# Altium schematic sheet [04]-Connector.SchDoc: ENTER SHEET TITLE
size B; Engineer: ENTER ENGINEER NAME; Organization: CUAir; Address1: L3, 12a Rodborough Rd; Address2: Frenchs Forest; Address3: NSW; Address4: Australia 2086; Revision: ENTER REVISION NUMBER; CompetitionYear: 2019; CPN: ENTER CPN; PROJECT: ENTER PROJECT NAME
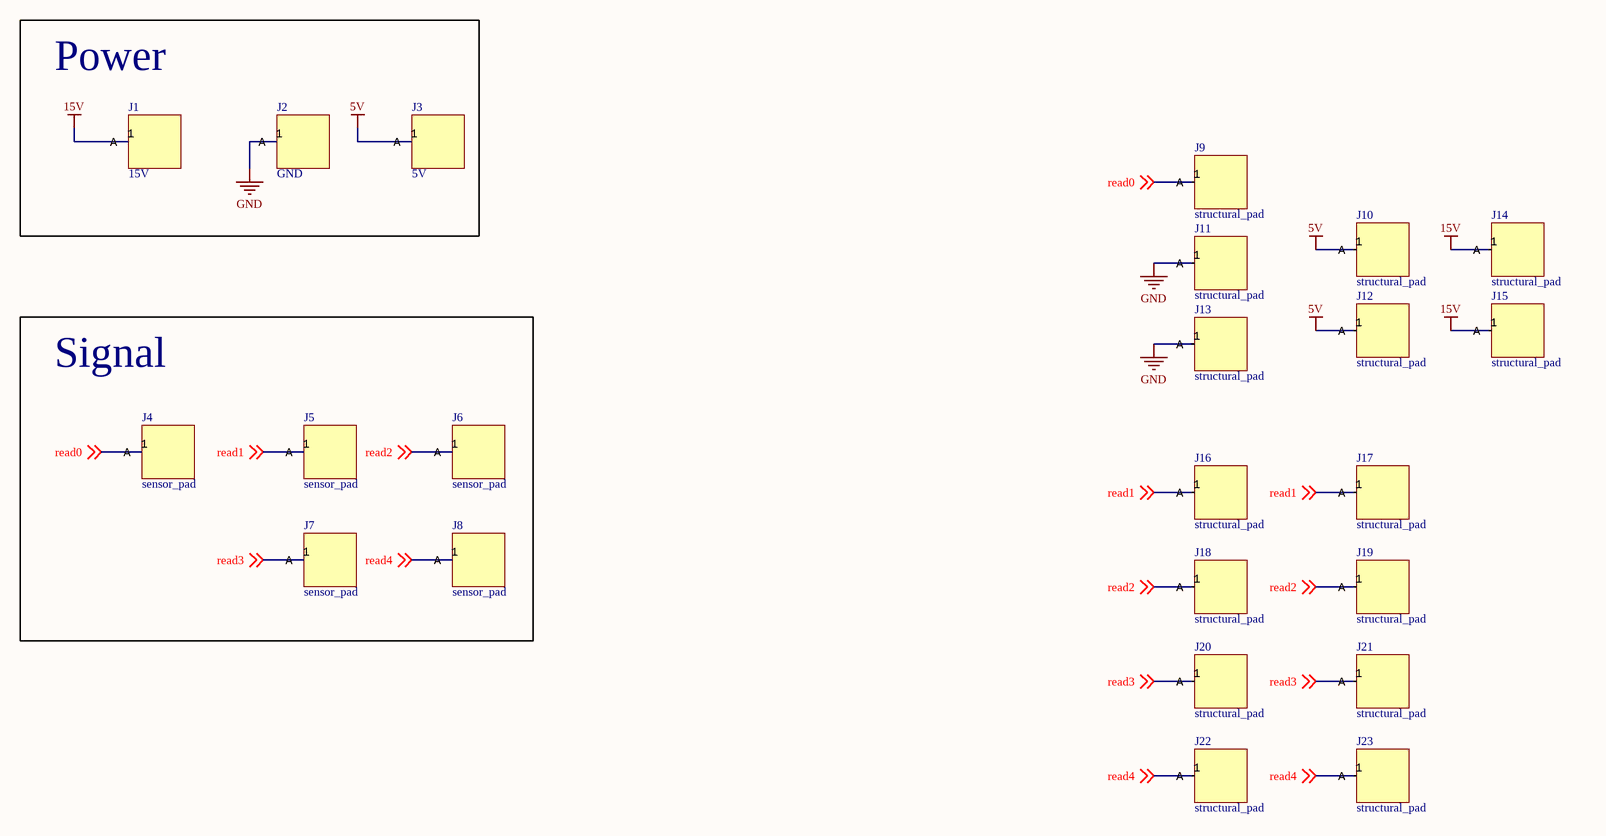
[diagram p0: [04]-Connector.SchDoc]

## Parts
J1  15V  [PIN]
J2  GND  [PIN]
J3  5V  [PIN]
J4  sensor_pad  [PIN]
J5  sensor_pad  [PIN]
J6  sensor_pad  [PIN]
J7  sensor_pad  [PIN]
J8  sensor_pad  [PIN]
J9  structural_pad  [structural_pad]
J10  structural_pad  [structural_pad]
J11  structural_pad  [structural_pad]
J12  structural_pad  [structural_pad]
J13  structural_pad  [structural_pad]
J14  structural_pad  [structural_pad]
J15  structural_pad  [structural_pad]
J16  structural_pad  [structural_pad]
J17  structural_pad  [structural_pad]
J18  structural_pad  [structural_pad]
J19  structural_pad  [structural_pad]
J20  structural_pad  [structural_pad]
J21  structural_pad  [structural_pad]
J22  structural_pad  [structural_pad]
J23  structural_pad  [structural_pad]

## Blocks framed on the sheet
Power: J1-J3
Signal: J4-J8

## Nets
5V: J3.1(A) J10.1(A) J12.1(A)
15V: J1.1(A) J14.1(A) J15.1(A)
GND: J2.1(A) J11.1(A) J13.1(A)
read0: J4.1(A) J9.1(A) ; off-sheet read0
read1: J5.1(A) J16.1(A) J17.1(A) ; off-sheet read1
read2: J6.1(A) J18.1(A) J19.1(A) ; off-sheet read2
read3: J7.1(A) J20.1(A) J21.1(A) ; off-sheet read3
read4: J8.1(A) J22.1(A) J23.1(A) ; off-sheet read4

## Notes on the sheet
- Project
- Title
- Size:
- Date:
- B
- Number:
- Revision:
- File:

## Library data of the parts
J3 = 15V